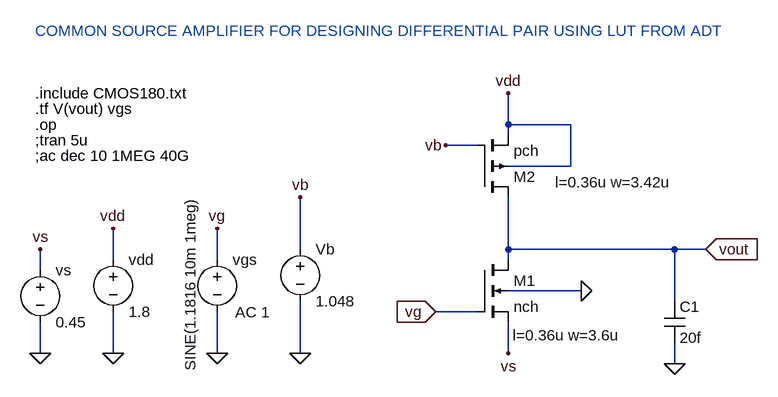
[diagram p0: schematic CSAmp_DiffPair.asc]
CSAmp_DiffPair.asc, the LTspice schematic file:
Version 4
SHEET 1 880 732
WIRE 352 64 352 16
WIRE 448 64 352 64
WIRE 352 80 352 64
WIRE 304 96 256 96
WIRE 448 128 448 64
WIRE 448 128 352 128
WIRE 32 256 32 176
WIRE 352 256 352 176
WIRE 608 256 352 256
WIRE 656 256 608 256
WIRE -256 272 -256 224
WIRE -96 272 -96 224
WIRE 352 272 352 256
WIRE -368 288 -368 256
WIRE 464 320 352 320
WIRE 608 336 608 256
WIRE 304 352 240 352
WIRE -368 416 -368 368
WIRE -256 416 -256 352
WIRE -96 416 -96 352
WIRE 32 416 32 336
WIRE 352 416 352 368
WIRE 608 432 608 400
FLAG -96 416 0
FLAG -256 416 0
FLAG -368 416 0
FLAG -368 256 vs
FLAG -256 224 vdd
FLAG -96 224 vg
FLAG 240 352 vg
IOPIN 240 352 In
FLAG 656 256 vout
IOPIN 656 256 In
FLAG 608 432 0
FLAG 352 16 vdd
FLAG 32 416 0
FLAG 32 176 vb
FLAG 256 96 vb
FLAG 352 416 vs
FLAG 464 320 0
SYMBOL nmos4 304 272 R0
WINDOW 123 55 116 Left 2
SYMATTR Value2 l=0.36u w=3.6u
SYMATTR InstName M1
SYMATTR Value nch
SYMBOL voltage -96 256 R0
WINDOW 3 -41 -81 VRight 2
WINDOW 123 28 97 Left 2
WINDOW 39 0 0 Left 0
SYMATTR Value SINE(1.1816 10m 1meg)
SYMATTR Value2 AC 1
SYMATTR InstName vgs
SYMBOL voltage -256 256 R0
WINDOW 123 0 0 Left 0
WINDOW 39 0 0 Left 0
SYMATTR InstName vdd
SYMATTR Value 1.8
SYMBOL cap 592 336 R0
SYMATTR InstName C1
SYMATTR Value 20f
SYMBOL pmos4 304 176 M180
WINDOW 123 120 23 Left 2
SYMATTR Value2 l=0.36u w=3.42u
SYMATTR InstName M2
SYMATTR Value pch
SYMBOL voltage 32 240 R0
WINDOW 123 0 0 Left 0
WINDOW 39 0 0 Left 0
SYMATTR InstName Vb
SYMATTR Value 1.048
SYMBOL voltage -368 272 R0
WINDOW 123 0 0 Left 0
WINDOW 39 0 0 Left 0
SYMATTR InstName vs
SYMATTR Value 0.45
TEXT -376 16 Left 2 !.include CMOS180.txt
TEXT -376 64 Left 2 !.op
TEXT -376 40 Left 2 !.tf V(vout) vgs
TEXT -376 88 Left 2 !;tran 5u
TEXT -376 -80 Left 2 ;COMMON SOURCE AMPLIFIER FOR DESIGNING DIFFERENTIAL PAIR USING LUT FROM ADT
TEXT -376 112 Left 2 !;ac dec 10 1MEG 40G

The netlist it stands for:
* CSAmp_DiffPair.asc
M1 vout vg vs 0 nch l=0.36u w=3.6u
vgs vg 0 SINE(1.1816 10m 1meg) AC 1
vdd vdd 0 1.8
C1 vout 0 20f
M2 vout vb vdd vdd pch l=0.36u w=3.42u
Vb vb 0 1.048
vs vs 0 0.45
.model NMOS NMOS
.model PMOS PMOS
.lib standard.mos
.include CMOS180.txt
.op
.tf V(vout) vgs
;tran 5u
* COMMON SOURCE AMPLIFIER FOR DESIGNING DIFFERENTIAL PAIR USING LUT FROM ADT
;ac dec 10 1MEG 40G
.backanno
.end